# EasyEDA Pro project Macro Pad.eprj

# Schematic Schematic1
Board Name: Board1; Create Date: 2024-01-24; Project Name: Macro Pad; Schematic Name: Schematic1; Update Date: 2024-09-08; Company: t; Drawn: Tiebe Groosman; Version: V0.2
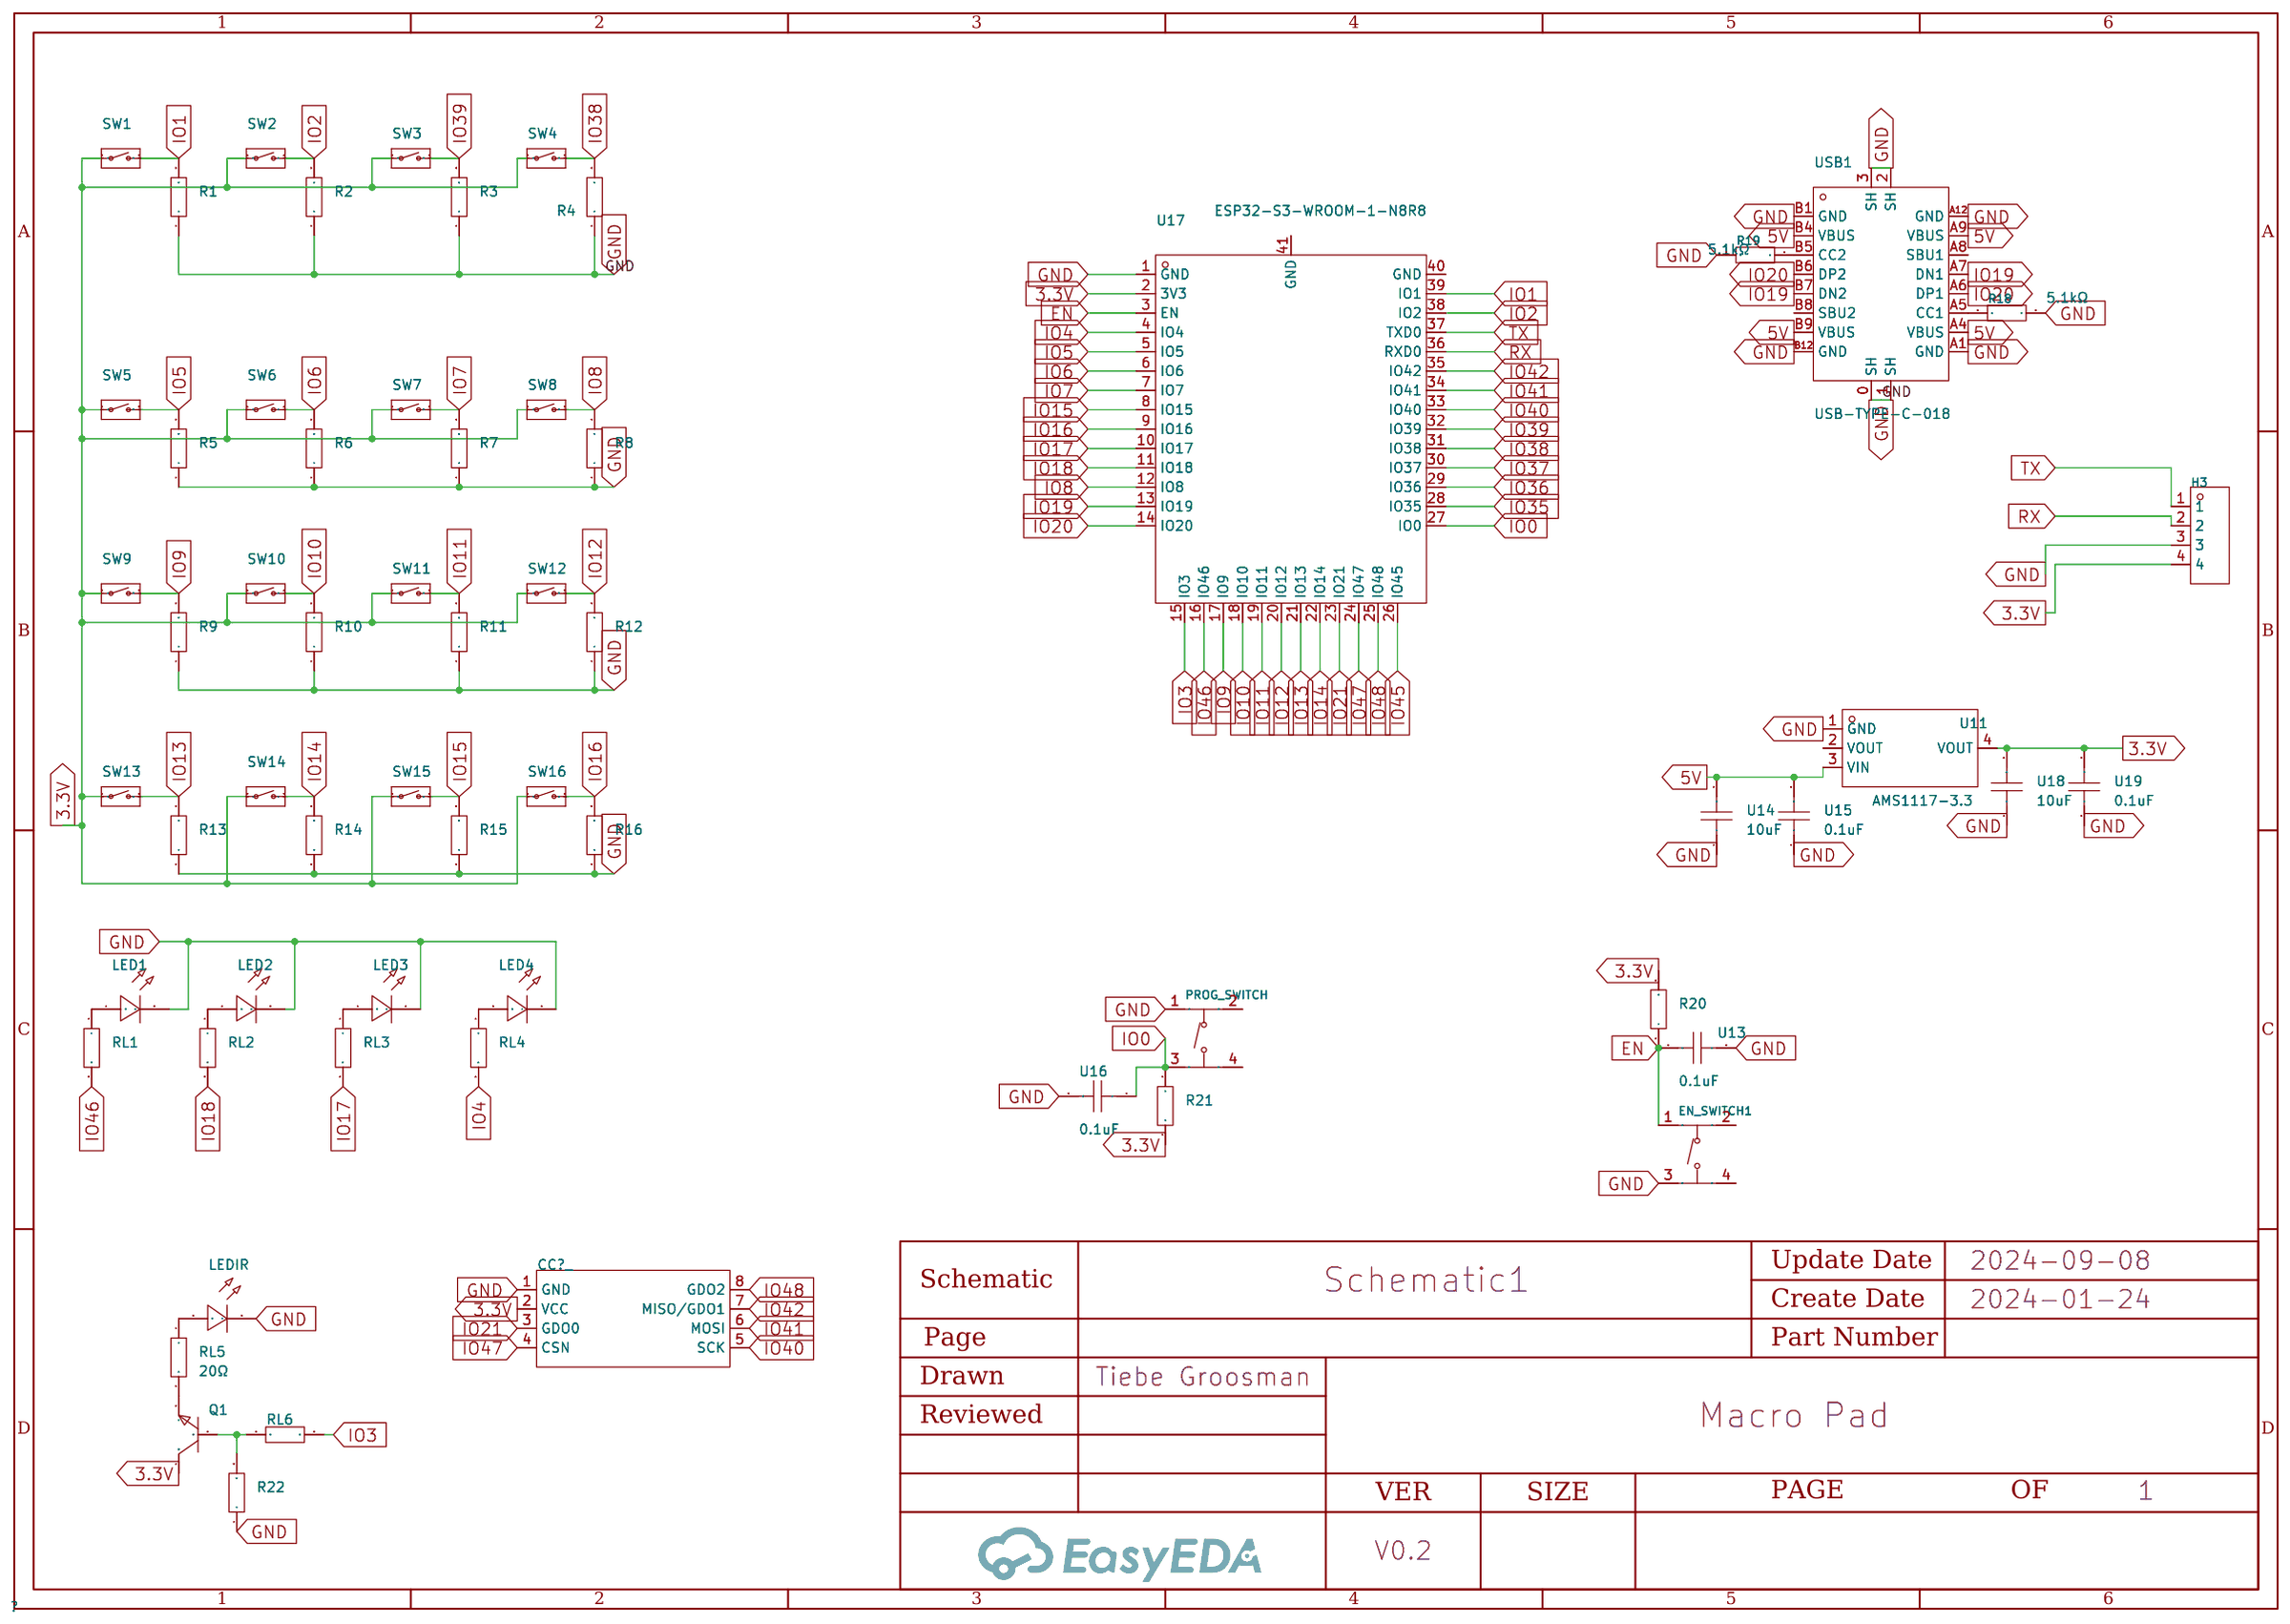
[diagram p0: schematic sheet]

## Parts
CC?_  -  [CC1101-BOARS]
EN_SWITCH1  TS-1187A-B-A-B  [SW-SMD_4P-L5.1-W5.1-P3.70-LS6.5-TL-2]
H3  -  [HDR-TH_4P-P2.54-V-M]
LED1  -  [LED-TH_BD5.8-P2.54-FD]
LED2  -  [LED-TH_BD5.8-P2.54-FD]
LED3  -  [LED-TH_BD5.8-P2.54-FD]
LED4  -  [LED-TH_BD5.8-P2.54-FD]
LEDIR  -  [LED-TH_BD5.8-P2.54-FD]
PROG_SWITCH  TS-1187A-B-A-B  [SW-SMD_4P-L5.1-W5.1-P3.70-LS6.5-TL-2]
Q1  -  [SOT-23_L2.9-W1.3-P1.90-LS2.4-BR]
R1  10.2kΩ  [R1210]
R2  10.2kΩ  [R1210]
R3  10.2kΩ  [R1210]
R4  10.2kΩ  [R1210]
R5  10.2kΩ  [R1210]
R6  10.2kΩ  [R1210]
R7  10.2kΩ  [R1210]
R8  10.2kΩ  [R1210]
R9  10.2kΩ  [R1210]
R10  10.2kΩ  [R1210]
R11  10.2kΩ  [R1210]
R12  10.2kΩ  [R1210]
R13  10.2kΩ  [R1210]
R14  10.2kΩ  [R1210]
R15  10.2kΩ  [R1210]
R16  10.2kΩ  [R1210]
R18  5.1kΩ  [R1210]
R19  5.1kΩ  [R1210]
R20  10.2kΩ  [R1210]
R21  10.2kΩ  [R1210]
R22  10.2kΩ  [R1210]
RL1  330Ω  [R1210]
RL2  330Ω  [R1210]
RL3  330Ω  [R1210]
RL4  330Ω  [R1210]
RL5  20Ω  [R1210]
RL6  330Ω  [R1210]
SW1  CHERRY-MX-LED  [CHERRYMX]
SW2  CHERRY-MX-LED  [CHERRYMX]
SW3  CHERRY-MX-LED  [CHERRYMX]
SW4  CHERRY-MX-LED  [CHERRYMX]
SW5  CHERRY-MX-LED  [CHERRYMX]
SW6  CHERRY-MX-LED  [CHERRYMX]
SW7  CHERRY-MX-LED  [CHERRYMX]
SW8  CHERRY-MX-LED  [CHERRYMX]
SW9  CHERRY-MX-LED  [CHERRYMX]
SW10  CHERRY-MX-LED  [CHERRYMX]
SW11  CHERRY-MX-LED  [CHERRYMX]
SW12  CHERRY-MX-LED  [CHERRYMX]
SW13  CHERRY-MX-LED  [CHERRYMX]
SW14  CHERRY-MX-LED  [CHERRYMX]
SW15  CHERRY-MX-LED  [CHERRYMX]
SW16  CHERRY-MX-LED  [CHERRYMX]
U11  AMS1117-3.3  [SOT-223-3_L6.5-W3.4-P2.30-LS7.0-BR]
U13  0.1uF  [C1210]
U14  10uF  [C1210]
U15  0.1uF  [C1210]
U16  0.1uF  [C1210]
U17  ESP32-S3-WROOM-1-N8R8  [WIRELM-SMD_ESP32-S3-WROOM-1]
U18  10uF  [C1210]
U19  0.1uF  [C1210]
USB1  USB-TYPE-C-018  [USB-C_SMD-TYPE-C-31-M-12]

## Library data of the parts
CC?_ = CC1101 Module
EN_SWITCH1 PROG_SWITCH = TS-1187A-B-A-B: Circuit:SPST Actuator Style:Round Button Operating Force:160gf Mounting Style:Brick nogging Switch Length:5.1mm Switch Width:5.1mm Switch Height:1.5mm Strike Gundam:不带 Contact Current:50mA Voltage Rating (DC):12V Insulation Resistance:- Actuator/Cap Color; LCSC Part Name: 5.1*5.1*1.5mm 立贴 轻触开关; Supplier Part: C318884; Manufacturer: XKB Connectivity(中国星坤); Supplier Footprint: SMD; JLCPCB Part Class: Basic Part; Datasheet: https://atta.szlcsc.com/upload/public/pdf/source/20200227/C318890_053E50208A88A7BA1965D8746000774E.pdf; Supplier: LCSC; Circuit: SPST; Actuator Style: Round Button; Operating Force: 160gf; Mounting Style: Brick nogging; Switch Length: 5.1mm; Switch Width: 5.1mm; Switch Height: 1.5mm; Strike Gundam: 不带; Contact Current: 50mA; Voltage Rating (DC): 12V; Actuator/Cap Color: 金色; With Lamp: No; Mechanical Life: 10万次; Operating Temperature: -30℃~+85℃
H3 = HDR-M_2.54_1x4P: Supplier Footprint: Through; Check: false
LED1-LED4 = LED_TH-R_5mm: Supplier Footprint: Through; Check: false
LEDIR = LED_TH-R_5mm: Supplier Footprint: Through
Q1 = S8050_NPN: Supplier Footprint: SOT-23
R1-R16 R20-R22 = 1210W2F1022T5E: Type:Thick Film Resistors Resistance:10200Ω Tolerance:±1% Tolerance:±1% Power(Watts): Overload Voltage (Max): Temperature Coefficient:±100ppm/℃ Temperature Coefficient:±100ppm/℃ Operating Temperature Range:-55℃~+155℃ Operating Temperature Range:-55℃~+155℃; LCSC Part Name: 10.2kΩ ±1% 500mW 厚膜电阻; Supplier Part: C407225; Manufacturer: UNI-ROYAL(厚声); Supplier Footprint: 1210; JLCPCB Part Class: Extended Part; Datasheet: https://atta.szlcsc.com/upload/public/pdf/source/20200306/C422600_1E6D84923E4A46A82E41ADD87F860B5C.pdf; Supplier: LCSC; Type: Thick Film Resistors; Tolerance: ±1%; Temperature Coefficient: ±100ppm/℃; Operating Temperature Range: -55℃~+155℃
R18 R19 = SCR1210J5K1: Type:Thick Film Resistors Resistance: Tolerance:±5% Tolerance:±5% Power(Watts): Overload Voltage (Max): Operating Temperature Range:-55℃~+155℃ Operating Temperature Range:-55℃~+155℃; LCSC Part Name: 厚膜电阻 5.1kΩ ±5% 500mW; Supplier Part: C3018207; Manufacturer: VO(翔胜); Supplier Footprint: 1210; JLCPCB Part Class: Extended Part; Datasheet: https://atta.szlcsc.com/upload/public/pdf/source/20220513/247AF9639BA21CF93567DC289CCC6A22.pdf; Supplier: LCSC; Type: Thick Film Resistors; Tolerance: ±5%; Operating Temperature Range: -55℃~+155℃; Temperature Coefficient: ±100ppm/℃
RL1-RL6 = RTT12331JTP: Type:Thick Film Resistors Resistance: Tolerance:±5% Tolerance:±5% Power(Watts): Overload Voltage (Max): Temperature Coefficient:±100ppm/℃ Temperature Coefficient:±100ppm/℃ Operating Temperature Range:-55℃~+155℃ Operating Temperature Range:-55℃~+155℃; LCSC Part Name: 厚膜电阻 330Ω ±5% 500mW; Supplier Part: C105006; Manufacturer: RALEC(旺诠); Supplier Footprint: 1210; JLCPCB Part Class: Extended Part; Datasheet: https://atta.szlcsc.com/upload/public/pdf/source/20191219/C158410_884373A5B7E1BC76BF57BC45A946C093.pdf; Supplier: LCSC; Type: Thick Film Resistors; Tolerance: ±5%; Temperature Coefficient: ±100ppm/℃; Operating Temperature Range: -55℃~+155℃
SW1-SW16 = CHERRY-MX-LED: Manufacturer Part: Cherry MX Green; Supplier: MechBoards.co.uk; Supplier Part: ACHERSW0115317; Manufacturer: Cherry; link: https://mechboards.co.uk/products/cherry-mx-green#full-description
U11 = AMS1117-3.3_C6186: LCSC Part Name: 输出3.3V 1A; Supplier Part: C6186; Manufacturer: AMS; Supplier Footprint: SOT-223; JLCPCB Part Class: Basic Part; Datasheet: https://atta.szlcsc.com/upload/public/pdf/source/20180727/C6186_7A095716F0823C02F1997A905E26C086.pdf; Supplier: LCSC; Output Voltage: 3.3V; MAX Output Current: 1A; Power Supply Rejection Ratio (PSRR): 72dB@(120Hz); Dropout Voltage: 1.3V@(800mA); Output Polarity: Positive electrode; Number of Outputs: 1
U13-U16 U18 U19 = CC1210KKX7R9BB105: Capacitance: Tolerance:±10% Tolerance:±10% Voltage Rated: Temperature Coefficient:; LCSC Part Name: 1uF ±10% 50V; Supplier Part: C393665; Manufacturer: YAGEO(国巨); Supplier Footprint: 1210; JLCPCB Part Class: Extended Part; Datasheet: https://atta.szlcsc.com/upload/public/pdf/source/20190520/C393665_3DDFDA27C82302498F1E69DB0F181365.pdf; Supplier: LCSC; Tolerance: ±10%; Voltage Rated: 50V
U17 = ESP32-S3-WROOM-1-N8R8: Supplier Part: C2913201; Manufacturer: ESPRESSIF(乐鑫); Supplier Footprint: SMD,25.5x18mm; JLCPCB Part Class: Extended Part; Datasheet: https://atta.szlcsc.com/upload/public/pdf/source/20240130/9D71F4DF55874C504AB629FEEE3F038E.pdf; Supplier: LCSC
USB1 = USB-TYPE-C-018: Connector Type:Type-C Standard:- Gender:Female Mounting Style:卧贴 Number of Contacts:16P Number of Ports:1 Current Rating - Power (Max):3A Operating Temperature Range:-25℃~+85℃ Operating Temperature Range:-25℃~+85℃; LCSC Part Name: Type-C 母 卧贴; Supplier Part: C2927038; Manufacturer: DEALON(德艺隆); Supplier Footprint: SMD; JLCPCB Part Class: Extended Part; Datasheet: https://atta.szlcsc.com/upload/public/pdf/source/20211217/CCD3D517E355E8E0CC52ABD8D5784AD8.pdf; Supplier: LCSC; Connector Type: Type-C; Gender: Female; Number of Ports: 1; Number of Contacts: 16P; Mounting Style: 卧贴; Current Rating - Power (Max): 3A; Operating Temperature Range: -25℃~+85℃

## Nets
3.3V: CC?_.2(VCC) H3.4 Q1.3(C) R20.2 R21.1 SW1.1 SW2.1 SW3.1 SW4.1 SW5.1 SW6.1 SW7.1 SW8.1 SW9.1 SW10.1 SW11.1 SW12.1 SW13.1 SW14.1 SW15.1 SW16.1 U11.4(VOUT) U17.2(3V3) U18.2 U19.2
5V: U11.3(VIN) U14.2 U15.2 USB1.A4(VBUS) USB1.A9(VBUS) USB1.B4(VBUS) USB1.B9(VBUS)
GND: CC?_.1(GND) EN_SWITCH1.3(C) H3.3 LED1.2(A) LED2.2(A) LED3.2(A) LED4.2(A) LEDIR.2(A) PROG_SWITCH.1(A) R1.1 R2.1 R3.1 R4.1 R5.1 R6.1 R7.1 R8.1 R9.1 R10.1 R11.1 R12.1 R13.1 R14.1 R15.1 R16.1 R18.1 R19.1 R22.1 U11.1(GND) U13.2 U14.1 U15.1 U16.2 U17.1(GND) U18.1 U19.1 USB1.0(SH) USB1.1(SH) USB1.2(SH) USB1.3(SH) USB1.A1(GND) USB1.A12(GND) USB1.B1(GND) USB1.B12(GND)
EN: EN_SWITCH1.1(A) R20.1 U13.1 U17.3(EN)
IO0: PROG_SWITCH.3(C) R21.2 U16.1 U17.27(IO0)
IO1: R1.2 SW1.2 U17.39(IO1)
IO2: R2.2 SW2.2 U17.38(IO2)
IO3: RL6.2 U17.15(IO3)
IO4: RL4.2 U17.4(IO4)
IO5: R5.2 SW5.2 U17.5(IO5)
IO6: R6.2 SW6.2 U17.6(IO6)
IO7: R7.2 SW7.2 U17.7(IO7)
IO8: R8.2 SW8.2 U17.12(IO8)
IO9: R9.2 SW9.2 U17.17(IO9)
IO10: R10.2 SW10.2 U17.18(IO10)
IO11: R11.2 SW11.2 U17.19(IO11)
IO12: R12.2 SW12.2 U17.20(IO12)
IO13: R13.2 SW13.2 U17.21(IO13)
IO14: R14.2 SW14.2 U17.22(IO14)
IO15: R15.2 SW15.2 U17.8(IO15)
IO16: R16.2 SW16.2 U17.9(IO16)
IO17: RL3.2 U17.10(IO17)
IO18: RL2.2 U17.11(IO18)
IO19: U17.13(IO19) USB1.A7(DN1) USB1.B7(DN2)
IO20: U17.14(IO20) USB1.A6(DP1) USB1.B6(DP2)
IO21: CC?_.3(GDO0) U17.23(IO21)
IO35: U17.28(IO35)
IO36: U17.29(IO36)
IO37: U17.30(IO37)
IO38: R4.2 SW4.2 U17.31(IO38)
IO39: R3.2 SW3.2 U17.32(IO39)
IO40: CC?_.5(SCK) U17.33(IO40)
IO41: CC?_.6(MOSI) U17.34(IO41)
IO42: CC?_.7(MISO/GDO1) U17.35(IO42)
IO45: U17.26(IO45)
IO46: RL1.2 U17.16(IO46)
IO47: CC?_.4(CSN) U17.24(IO47)
IO48: CC?_.8(GDO2) U17.25(IO48)
RX: H3.2 U17.36(RXD0)
TX: H3.1 U17.37(TXD0)
$1N17024: LED1.1(C) RL1.1
$1N17244: LED2.1(C) RL2.1
$1N17270: LED3.1(C) RL3.1
$1N17296: LED4.1(C) RL4.1
$1N41929: R18.2 USB1.A5(CC1)
$1N42156: R19.2 USB1.B5(CC2)
$1N52929: LEDIR.1(C) RL5.1
$1N52957: Q1.2(E) RL5.2
$1N53158: Q1.1(B) R22.2 RL6.1

Not connected (* = marked no-connect by the designer): EN_SWITCH1 2(B) 4(D); PROG_SWITCH 2(B) 4(D); U11 2(VOUT); U17 40(GND) 41(GND); USB1 A8(SBU1) B8(SBU2)

# Board PCB4
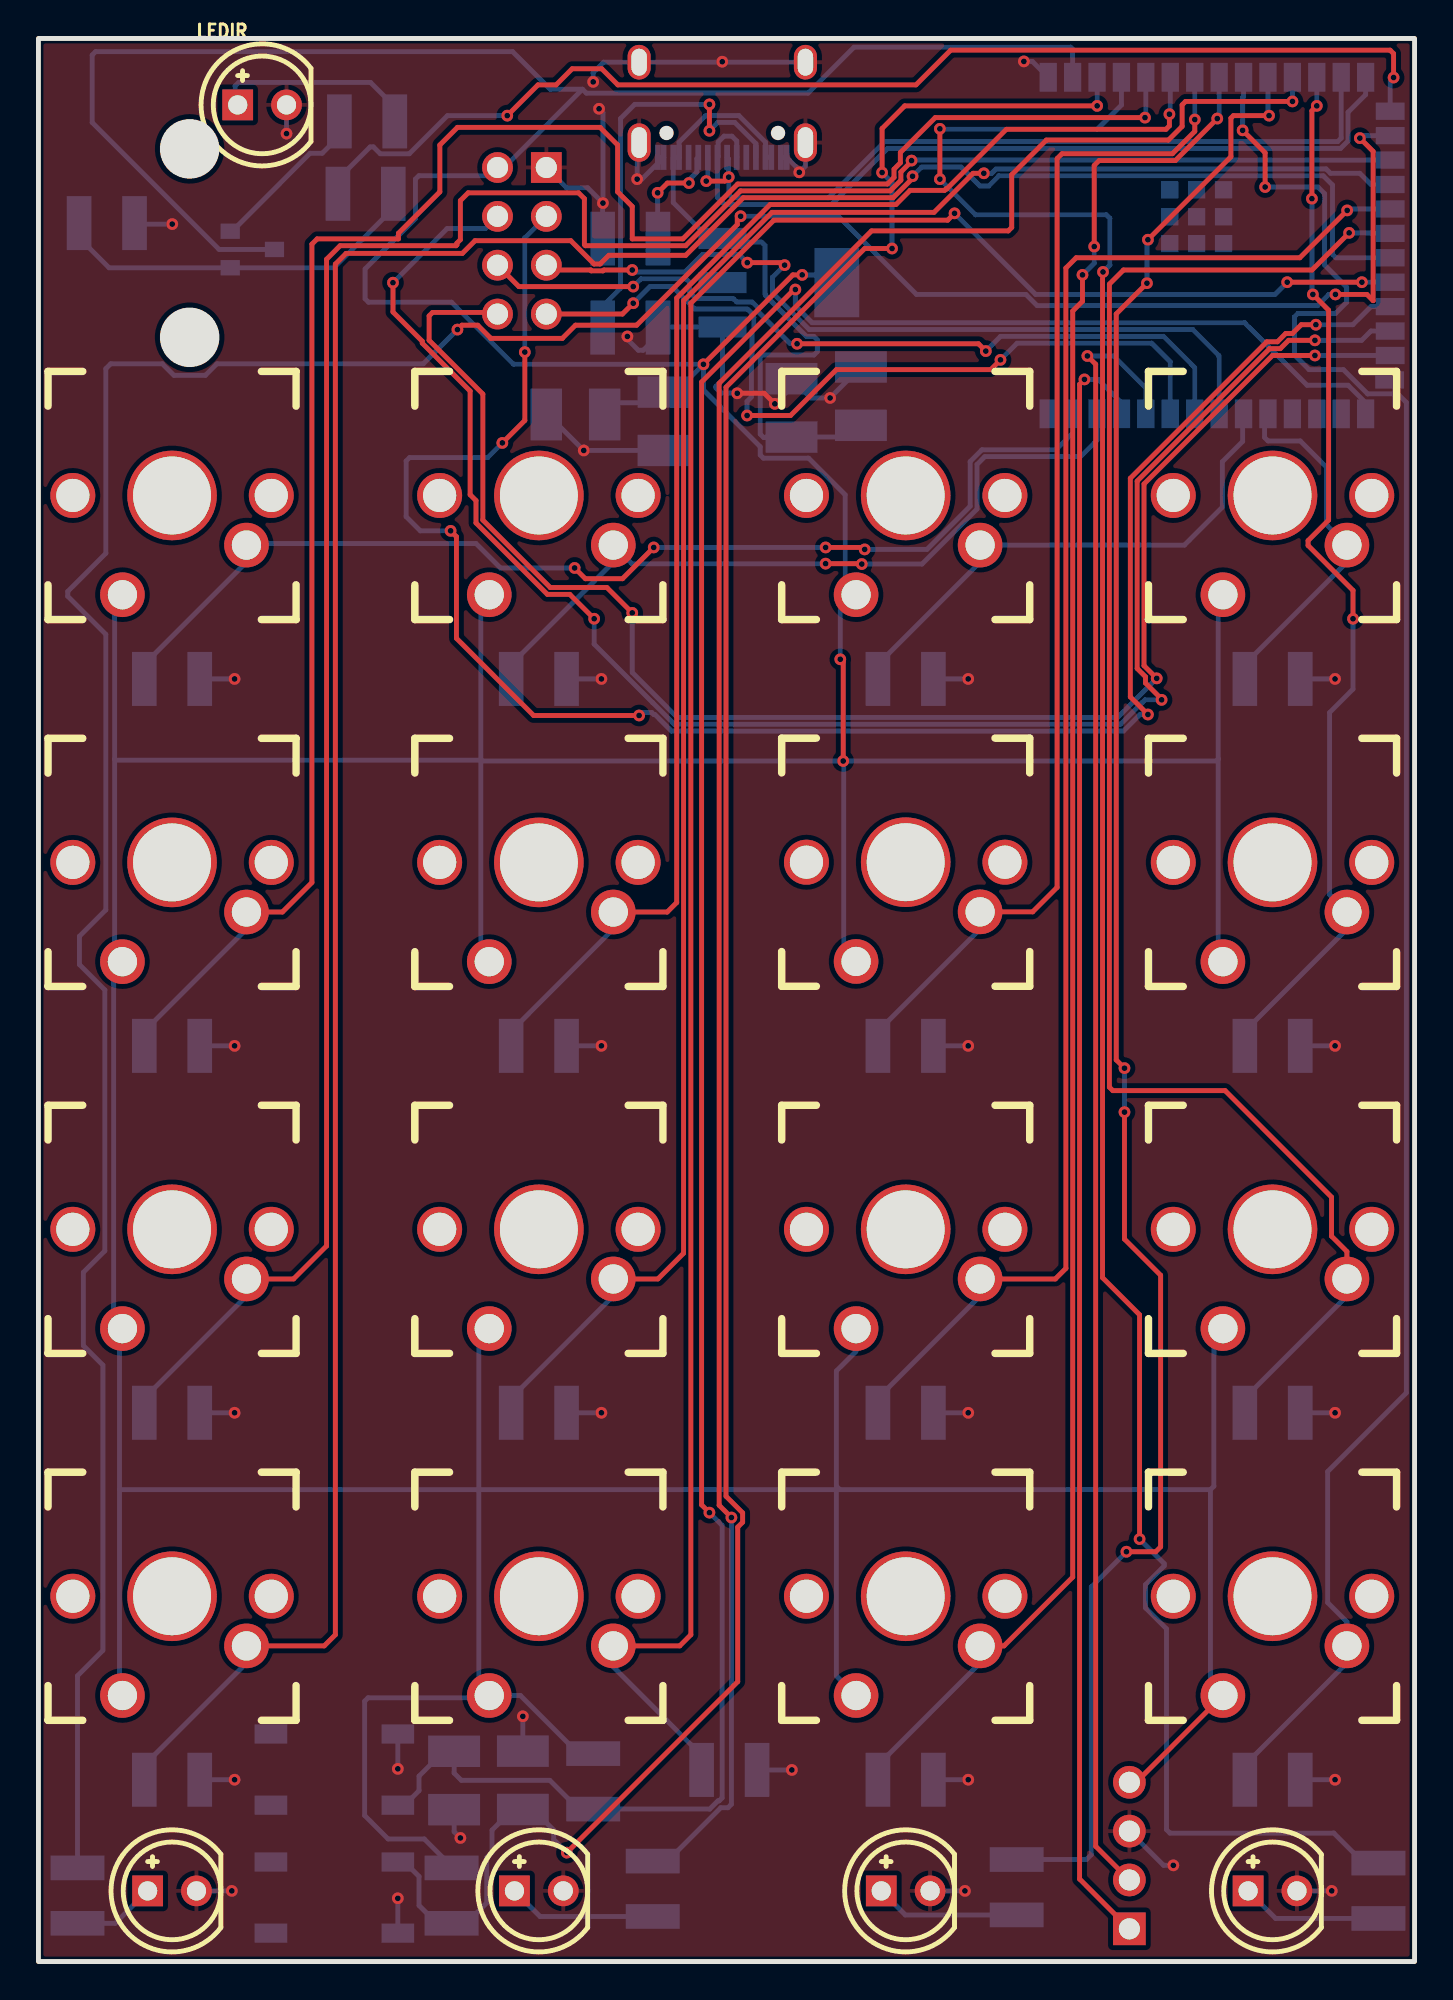
[diagram p1: board, top side]
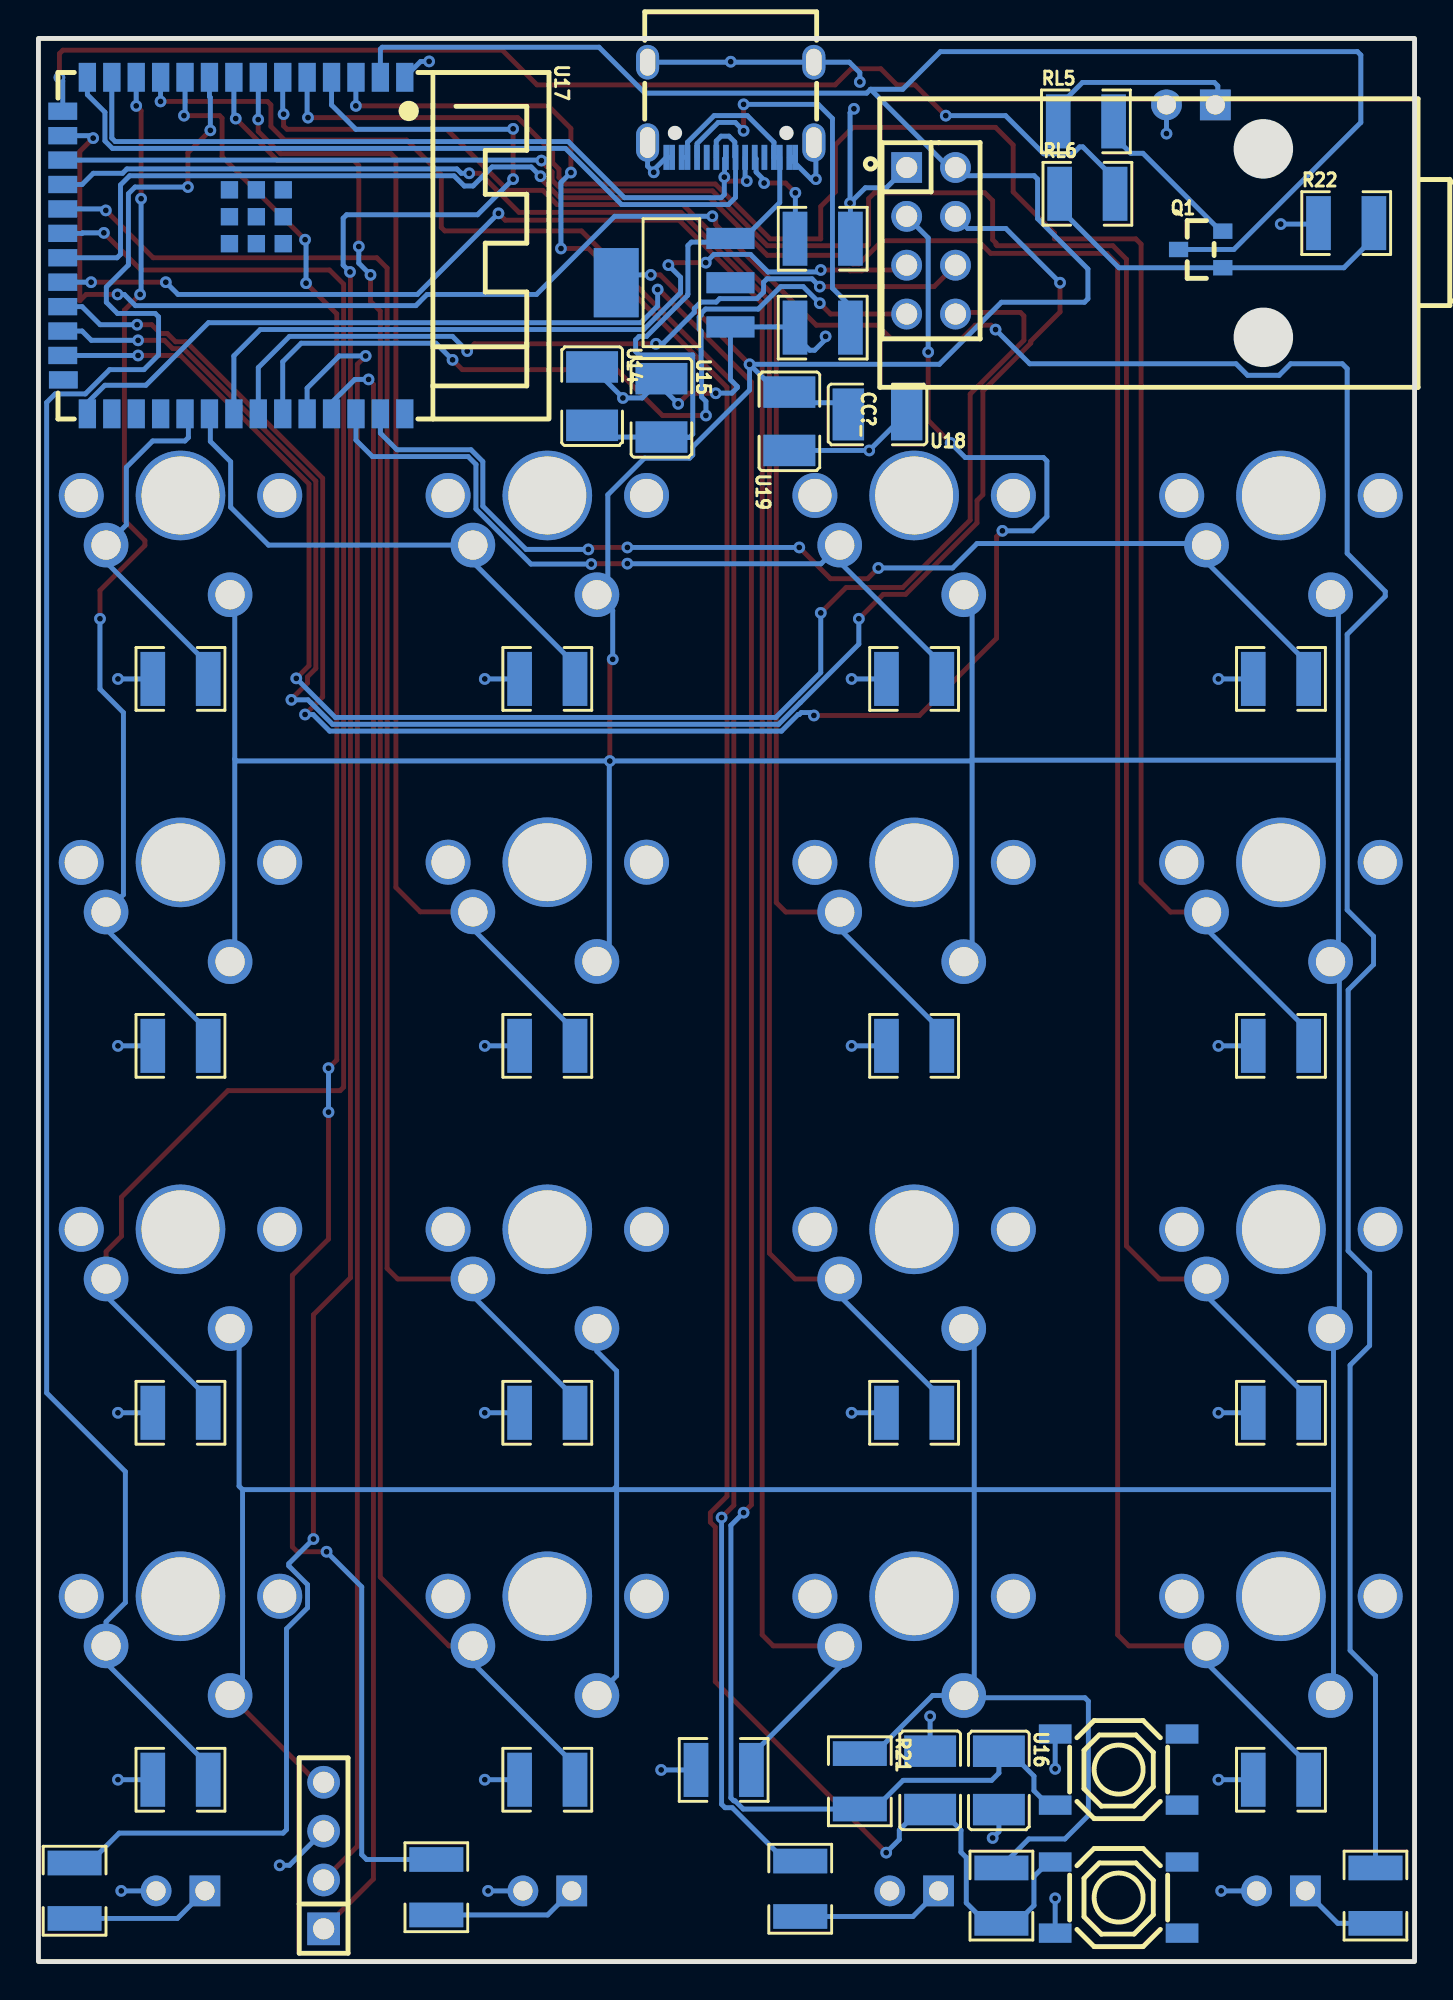
[diagram p2: board, bottom side, seen from below]

Outline 71.58 x 100 mm; copper layers: Top Layer, Bottom Layer. Coordinates in mm from the lower left corner of the outline.
Outline path: rectangle 0,100 71.58,0
Stack: Top Layer 0.035mm / Dielectric1 1.51mm FR4 er 4.5 / Bottom Layer 0.035mm

## Design rules (mm)
template: JLCPCB Capability(Two Layers Board)
spacing copperThickness1oz (default): track to track 0.102, other pairs 0.152 to 0.3
spacing copperThickness2oz: track to track 0.203, other pairs 0.152 to 0.3
track width copperThickness1oz (default): min 0.127, default 0.254, max 2.54
track width copperThickness2oz: min 0.203, default 0.254, max 2.54
differential pair differentialPair (default): width min 0.127, default 0.254, max 2.54; gap min 0.152, default 0.152
via viaSize (default): diameter min 0.5, default 0.61, max 10; hole min 0.3, default 0.305, max 6.3

## Placement (name value [footprint] x y rotation side)
CC?_  -  [CC1101-BOARS]  14.21 89.43 90 bottom
EN_SWITCH1  TS-1187A-B-A-B  [SW-SMD_4P-L5.1-W5.1-P3.70-LS6.5-TL-2]  15.39 3.33 180 bottom
H3  -  [HDR-TH_4P-P2.54-V-M]  56.74 5.51 90 bottom
LED1  -  [LED-TH_BD5.8-P2.54-FD]  6.95 3.67 0 top
LED2  -  [LED-TH_BD5.8-P2.54-FD]  26.03 3.67 0 top
LED3  -  [LED-TH_BD5.8-P2.54-FD]  45.11 3.67 0 top
LED4  -  [LED-TH_BD5.8-P2.54-FD]  64.19 3.67 0 top
LEDIR  -  [LED-TH_BD5.8-P2.54-FD]  11.63 96.54 0 top
PROG_SWITCH  TS-1187A-B-A-B  [SW-SMD_4P-L5.1-W5.1-P3.70-LS6.5-TL-2]  15.39 9.98 180 bottom
Q1  -  [SOT-23_L2.9-W1.3-P1.90-LS2.4-BR]  11.12 89.03 180 bottom
R1  10.2kΩ  [R1210]  6.95 66.7 180 bottom
R2  10.2kΩ  [R1210]  26.03 66.7 180 bottom
R3  10.2kΩ  [R1210]  45.11 66.7 180 bottom
R4  10.2kΩ  [R1210]  64.19 66.7 180 bottom
R5  10.2kΩ  [R1210]  6.95 47.62 180 bottom
R6  10.2kΩ  [R1210]  26.03 47.62 180 bottom
R7  10.2kΩ  [R1210]  45.11 47.62 180 bottom
R8  10.2kΩ  [R1210]  64.19 47.62 180 bottom
R9  10.2kΩ  [R1210]  6.95 28.54 180 bottom
R10  10.2kΩ  [R1210]  26.03 28.54 180 bottom
R11  10.2kΩ  [R1210]  45.11 28.54 180 bottom
R12  10.2kΩ  [R1210]  64.19 28.54 180 bottom
R13  10.2kΩ  [R1210]  6.95 9.46 180 bottom
R14  10.2kΩ  [R1210]  35.93 9.96 180 bottom
R15  10.2kΩ  [R1210]  45.11 9.46 180 bottom
R16  10.2kΩ  [R1210]  64.19 9.46 180 bottom
R18  5.1kΩ  [R1210]  30.78 89.59 0 bottom
R19  5.1kΩ  [R1210]  30.78 84.96 180 bottom
R20  10.2kΩ  [R1210]  21.49 3.43 90 bottom
R21  10.2kΩ  [R1210]  28.85 9.37 270 bottom
R22  10.2kΩ  [R1210]  3.56 90.4 180 bottom
RL1  330Ω  [R1210]  2.03 3.43 90 bottom
RL2  330Ω  [R1210]  31.95 3.78 90 bottom
RL3  330Ω  [R1210]  50.88 3.86 90 bottom
RL4  330Ω  [R1210]  69.7 3.68 90 bottom
RL5  20Ω  [R1210]  17.09 95.69 180 bottom
RL6  330Ω  [R1210]  17.02 91.92 180 bottom
SW1  CHERRY-MX-LED  [CHERRYMX]  6.95 76.24 0 top
SW2  CHERRY-MX-LED  [CHERRYMX]  26.03 76.24 0 top
SW3  CHERRY-MX-LED  [CHERRYMX]  45.11 76.24 0 top
SW4  CHERRY-MX-LED  [CHERRYMX]  64.19 76.24 0 top
SW5  CHERRY-MX-LED  [CHERRYMX]  6.95 57.16 0 top
SW6  CHERRY-MX-LED  [CHERRYMX]  26.03 57.16 0 top
SW7  CHERRY-MX-LED  [CHERRYMX]  45.11 57.17 0 top
SW8  CHERRY-MX-LED  [CHERRYMX]  64.19 57.16 0 top
SW9  CHERRY-MX-LED  [CHERRYMX]  6.95 38.08 0 top
SW10  CHERRY-MX-LED  [CHERRYMX]  26.03 38.08 0 top
SW11  CHERRY-MX-LED  [CHERRYMX]  45.11 38.08 0 top
SW12  CHERRY-MX-LED  [CHERRYMX]  64.19 38.08 0 top
SW13  CHERRY-MX-LED  [CHERRYMX]  6.95 19 0 top
SW14  CHERRY-MX-LED  [CHERRYMX]  26.03 19 0 top
SW15  CHERRY-MX-LED  [CHERRYMX]  45.11 19 0 top
SW16  CHERRY-MX-LED  [CHERRYMX]  64.19 19 0 top
U11  AMS1117-3.3  [SOT-223-3_L6.5-W3.4-P2.30-LS7.0-BR]  38.55 87.3 180 bottom
U13  0.1uF  [C1210]  25.2 9.42 90 bottom
U14  10uF  [C1210]  42.78 81.4 270 bottom
U15  0.1uF  [C1210]  39.17 80.79 270 bottom
U16  0.1uF  [C1210]  21.62 9.42 270 bottom
U17  ESP32-S3-WROOM-1-N8R8  [WIRELM-SMD_ESP32-S3-WROOM-1]  61.42 89.23 270 bottom
U18  10uF  [C1210]  27.93 80.45 0 bottom
U19  0.1uF  [C1210]  32.52 80.09 90 bottom
USB1  USB-TYPE-C-018  [USB-C_SMD-TYPE-C-31-M-12]  35.57 96.29 0 bottom

## Footprints (pads in the part's own frame, mm; a bottom-side part is the same pattern mirrored in y, then rotated)
C1210
  rect 1.635x2.7 smd: 1(-1.518,0) 2(1.518,0)
CC1101-BOARS
  rect 1.6x1.6 hole 1.1: 1(3.856,12.203)
  round 1.6 hole 1.1: 2(3.856,9.663) 3(1.316,12.203) 4(1.316,9.663) 5(-1.224,12.203) 6(-1.224,9.663) 7(-3.764,12.203) 8(-3.764,9.663)
CHERRYMX
  round 2.321 hole 1.524: 1(-2.58,-5.162) 2(3.871,-2.58)
  round 2.34 hole 1.727: 3(5.162,0) 4(-5.162,0)
  round 4.661 hole 4.054: 5(0,0)
HDR-TH_4P-P2.54-V-M
  rect 1.7x1.7 hole 1.1: 1(-3.81,0)
  round 1.7 hole 1.1: 2(-1.27,0) 3(1.27,0) 4(3.81,0)
LED-TH_BD5.8-P2.54-FD
  rect 1.6x1.6 hole 1: 1(-1.27,0)
  round 1.6 hole 1: 2(1.27,0)
R1210
  rect 1.282x2.808 smd: 1(-1.441,0) 2(1.441,0)
SOT-23_L2.9-W1.3-P1.90-LS2.4-BR
  rect 1x0.8 smd: 1(1.15,-0.95) 2(1.15,0.95) 3(-1.15,0)
SOT-223-3_L6.5-W3.4-P2.30-LS7.0-BR
  rect 2.5x1.1 smd: 1(2.97,-2.3) 2(2.97,0) 3(2.97,2.3)
  rect 2.34x3.6 smd: 4(-2.97,0)
SW-SMD_4P-L5.1-W5.1-P3.70-LS6.5-TL-2
  rect 1.7x1 smd: 1(-3.3,1.85) 2(3.3,1.85) 3(-3.3,-1.85) 4(3.3,-1.85)
USB-C_SMD-TYPE-C-31-M-12
  oval 1.2x2 hole 0.8x1.6: 0(-4.325,1.706) 1(4.325,1.706)
  oval 1.2x1.8 hole 0.8x1.4: 2(4.325,-2.474) 3(-4.325,-2.474)
  rect 0.3x1.3 smd: A1(-3.35,2.474) A4(-2.55,2.474) A5(-1.25,2.474) A6(-0.25,2.474) A7(0.25,2.474) A8(1.25,2.474) A9(2.55,2.474) A12(3.35,2.474) B1(3.05,2.474) B4(2.25,2.474) B5(1.75,2.474) B6(0.75,2.474) B7(-0.75,2.474) B8(-1.75,2.474) B9(-2.25,2.474) B12(-3.05,2.474)
WIRELM-SMD_ESP32-S3-WROOM-1
  rect 1.5x0.9 smd: 1(-8.75,8.895) 2(-8.75,7.625) 3(-8.75,6.355) 4(-8.75,5.085) 5(-8.75,3.815) 6(-8.75,2.545) 7(-8.75,1.275) 8(-8.75,0.005) 9(-8.75,-1.265) 10(-8.75,-2.535) 11(-8.75,-3.805) 12(-8.75,-5.075) 13(-8.75,-6.345) 14(-8.75,-7.615) 27(8.75,-7.615) 28(8.75,-6.345) 29(8.75,-5.075) 30(8.75,-3.805) 31(8.75,-2.535) 32(8.75,-1.265) 33(8.75,0.005) 34(8.75,1.275) 35(8.75,2.545) 36(8.75,3.815) 37(8.75,5.085) 38(8.75,6.355) 39(8.75,7.625) 40(8.75,8.895)
  rect 0.9x1.5 smd: 15(-6.985,-8.895) 16(-5.715,-8.895) 17(-4.445,-8.895) 18(-3.175,-8.895) 19(-1.905,-8.895) 20(-0.635,-8.895) 21(0.635,-8.895) 22(1.905,-8.895) 23(3.175,-8.895) 24(4.445,-8.895) 25(5.715,-8.895) 26(6.985,-8.865)
  rect 0.9x0.9 smd: 41(-2.9,-0.225) 41(-2.9,1.175) 41(-2.9,2.575) 41(-1.5,-0.225) 41(-1.5,1.175) 41(-1.5,2.575) 41(-0.1,-0.225) 41(-0.1,1.175) 41(-0.1,2.575)

## Nets
As in the schematic.

Pads without a net: EN_SWITCH1 2 4; PROG_SWITCH 2 4; SW1 3 4 5; SW2 3 4 5; SW3 3 4 5; SW4 3 4 5; SW5 3 4 5; SW6 3 4 5; SW7 3 4 5; SW8 3 4 5; SW9 3 4 5; SW10 3 4 5; SW11 3 4 5; SW12 3 4 5; SW13 3 4 5; SW14 3 4 5; SW15 3 4 5; SW16 3 4 5; U11 2; U17 40 41; USB1 A8 B8

## Via types
v1: diameter 0.61, hole 0.305, Top Layer to Bottom Layer, 122 vias

## Routing (per net, layer and track width the routed paths; a pad name or vN(x,y) marks a point on that pad's centre or on a via; arc(x,y) is an arc through that point)
3.3V: length 459.9
  Top Layer w0.254: SW16.1 57.1,9.32 H3.4 ; v1(41.71,67.72) 41.86,67.56 v1(41.86,62.43) ; v1(39.73,87.71) 39.24,87.71 v1(34.59,83.06)
  Bottom Layer w0.254: 60.96,24.54 60.96,14.48 SW16.1 ; 60.96,24.54 41.68,24.54 41.5,24.72 41.5,30.71 42.53,31.73 SW11.1 ; 60.96,24.54 61.14,24.72 61.14,32.45 SW12.1 ; U11.4 41.12,87.71 v1(39.73,87.71) ; 61.62,71.07 61.37,70.82 61.37,62.53 ; 61.37,62.53 61.26,62.43 41.89,62.43 41.89,52.65 SW7.1 ; 61.37,62.53 61.37,52.24 SW8.1 ; 53.79,98.08 53.79,99.45 53.7,99.54 42.42,99.54 40.03,97.16 28.5,97.16 28.3,97.36 ; v1(34.59,83.06) 34.59,81.72 37.54,78.77 37.54,78.34 37.71,78.18 40.06,78.18 41.96,76.27 41.96,71.64 SW3.1 41.71,70.25 v1(41.71,67.72) ; v1(34.59,83.06) 24.72,83.06 21.49,86.28 17.17,86.28 16.99,86.46 16.99,88.01 19.61,90.63 19.61,92.68 19.79,92.86 23.45,92.86 CC?_.2 24.23,93.29 28.3,97.36 ; v1(34.59,83.06) 33.14,81.61 U19.2 31.96,81.06 29.45,81.06 ; SW14.1 25.07,13.83 28.09,10.81 R21.1 ; SW14.1 22.9,14.38 22.9,24.54 ; SW14.1 23.33,13.72 17.15,13.72 16.97,13.54 16.97,7.59 18.19,6.37 20.07,6.37 21.49,4.95 R20.2 ; 22.9,24.54 4.22,24.54 ; 22.9,24.54 22.9,32.37 SW10.1 ; 22.9,24.54 41.5,24.54 41.5,14.86 SW15.1 ; 4.22,24.54 4.22,13.99 SW13.1 ; 4.22,24.54 4.22,32.76 SW9.1 3.91,33.37 3.91,51.54 SW5.1 3.96,52.4 3.96,62.51 ; 23.01,62.51 23.09,62.43 41.71,62.43 ; 23.01,62.51 23.01,52.43 SW6.1 ; 23.01,62.51 23.01,70.64 SW2.1 ; 23.01,62.51 22.97,62.47 4,62.47 3.96,62.51 ; 28.3,97.36 26.62,97.36 24.66,99.32 2.97,99.32 2.79,99.14 2.79,95.63 9.4,89.03 Q1.3 ; 3.96,62.51 3.96,70.67 SW1.1
5V: length 35.5
  Bottom Layer w0.254: USB1.A9 USB1.B4 37.82,94.6 36.43,95.99 34.71,95.99 33.32,94.6 USB1.B9 USB1.A4 33.02,91.46 34.88,89.6 U11.3 35.77,89.41 37.62,89.41 37.8,89.23 37.8,86.69 37.82,86.67 37.82,86.63 39.94,84.51 40.33,84.51 40.51,84.33 40.51,83.72 40.33,83.54 37.54,83.54 37.54,79.43 37.72,79.25 37.82,79.25 37.85,79.27 U15.2 42.17,79.27 U14.2
GND: length 105.9
  Top Layer w0.254: v1(38.3,81) 37.75,81.55 v1(36.35,81.55)
  Bottom Layer w0.254: 8.39,28.54 v1(10.2,28.54) ; R11.1 v1(48.36,28.54) ; 8.39,66.7 v1(10.2,66.7) ; v1(59.03,5) 58.52,5 H3.3 ; v1(36.35,81.55) 36.34,81.56 35.51,81.56 35.23,81.84 35.23,81.91 35.58,82.26 U11.1 32.54,85 32.23,85.32 32.23,84.56 31.46,83.79 31.2,83.79 30.63,84.36 v1(30.63,84.51) ; v1(29.36,91.44) 29.34,91.42 29.34,88.82 ; v1(29.36,91.44) 29.36,96.14 v1(29.16,96.34) ; v1(29.36,91.44) 28.57,92.23 27.47,92.23 CC?_.1 ; USB1.A1 USB1.B12 31.39,92.68 v1(31.14,92.68) 31.14,94.48 USB1.0 ; R3.1 v1(48.36,66.7) ; 26.42,80.45 26.49,80.45 v1(28.36,78.58) U19.1 ; 8.39,47.62 v1(10.2,47.62) ; R4.1 v1(67.44,66.7) ; R16.1 v1(67.44,9.46) ; v1(51.26,98.81) 51.7,98.81 U17.1 ; 46.55,47.62 v1(48.36,47.62) ; R6.1 v1(29.28,47.62) ; USB1.B1 USB1.A12 39.57,93.16 v1(39.57,93.04) 39.89,93.36 USB1.1 ; 27.47,28.54 v1(29.28,28.54) ; U16.2 21.62,6.75 v1(21.95,6.43) ; USB1.2 35.59,98.76 v1(35.57,98.79) 35.54,98.76 USB1.3 29.4,98.76 28.85,98.22 v1(28.85,97.74) ; LED1.2 v1(10.06,3.67) ; 65.63,47.62 v1(67.44,47.62) ; R14.1 v1(39.19,9.96) ; R15.1 v1(48.36,9.46) ; 5.4,90.35 v1(6.96,90.35) ; 8.39,9.46 v1(10.2,9.46) ; PROG_SWITCH.1 v1(18.69,10.02) ; LEDIR.2 v1(12.9,95.05) ; v1(38.3,81) 39.17,81.87 U15.1 40.18,81.3 v1(41.18,81.3) 41.18,81.31 U14.1 ; LED3.2 v1(48.19,3.67) ; R12.1 v1(67.44,28.54) ; U13.2 v1(25.2,12.75) ; LED4.2 v1(67.27,3.67) ; 27.47,66.7 v1(29.28,66.7) ; EN_SWITCH1.3 v1(18.69,3.29)
EN: length 128.3
  Top Layer w0.254: v1(44.4,89.08) 42.98,89.08 35.76,81.86 35.76,24.19 36.63,23.33 36.63,22.85 36.37,22.59 36.37,14.55 v1(27.48,5.66) ; v1(55.07,96.49) 45.06,96.49 43.88,95.32 v1(43.88,93.03)
  Bottom Layer w0.254: v1(44.4,89.08) 44.4,92.51 v1(43.88,93.03) ; U17.3 55.07,97.97 v1(55.07,96.49) ; EN_SWITCH1.1 19.04,5.18 19.8,4.42 19.8,2.92 20.73,1.99 R20.1 22.25,1.99 23.32,3.05 23.32,5.41 23.59,5.69 23.59,6.83 24.66,7.91 U13.1 25.73,7.91 26.8,6.83 26.8,6.35 v1(27.48,5.66)
IO0: length 134.7
  Top Layer w0.254: v1(39.37,86.94) 39.3,86.94 34.49,82.13 34.49,23.75 v1(34.9,23.34)
  Bottom Layer w0.254: PROG_SWITCH.3 19.04,8.13 19.8,8.89 19.8,9.64 21.09,10.93 U16.1 21.62,9.8 22,9.42 26.6,9.42 28.09,7.93 R21.2 34.92,7.93 35.34,8.36 35.41,8.36 35.56,8.51 35.56,22.68 v1(34.9,23.34) ; U17.27 69.03,81.06 68.12,81.97 65.99,81.97 62.73,85.22 40.24,85.22 39.37,86.09 v1(39.37,86.94)
IO1: length 58.5
  Top Layer w0.254: v1(32,73.53) 30.38,71.91 28.45,71.91 v1(27.89,72.47) ; v1(42.98,73.43) 42.87,73.53 v1(40.94,73.53)
  Bottom Layer w0.254: U17.39 53.79,79.48 52.93,78.61 49.08,78.61 48.46,78 48.46,75.68 46.22,73.43 v1(42.98,73.43) ; v1(27.89,72.47) 24.03,72.47 22.76,73.74 10.9,73.74 SW1.2 10.82,72.77 5.51,67.46 R1.2 ; v1(40.94,73.53) v1(32,73.53)
IO2: length 40.1
  Top Layer w0.254: v1(42.82,72.67) 42.8,72.69 v1(40.94,72.69)
  Bottom Layer w0.254: R2.2 24.59,67.46 29.9,72.77 SW2.2 30.87,72.68 40.94,72.68 v1(40.94,72.69) ; v1(42.82,72.67) 45.96,72.67 48.82,75.53 48.82,77.85 49.23,78.26 54.2,78.26 55.06,79.12 U17.38
IO3: length 62.6
  Top Layer w0.254: v1(70.49,97.97) 70.49,99.21 70.31,99.39 47.45,99.39 45.64,97.59 30.14,97.59 29.3,98.42 27.76,98.42 26.92,97.59 25.98,97.59 v1(24.38,95.99)
  Bottom Layer w0.254: U17.15 70.31,97.79 v1(70.49,97.97) ; RL6.2 15.58,92.68 17.25,94.36 17.42,94.36 17.78,94 19.29,94 21.27,95.99 v1(24.38,95.99)
IO4: length 121.5
  Top Layer w0.254: 55.37,87.66 v1(55.37,87.86) ; v1(46.89,92.68) v1(46.89,95.3) ; v1(57.27,21.97) 57.27,33.63 55.35,35.56 55.35,87.53
  Bottom Layer w0.254: RL4.2 68.93,5.12 67.38,6.68 58.85,6.68 58.67,6.86 58.67,17.3 57.58,18.4 57.58,19.6 58.56,20.57 58.56,20.69 v1(57.27,21.97) ; v1(46.89,92.68) 48.74,90.83 55.55,90.83 55.73,90.65 55.73,88.21 v1(55.37,87.86) ; v1(46.89,95.3) 46.91,95.27 55.07,95.27 56.33,96.54 56.33,97.98
IO5: length 104
  Top Layer w0.254: v1(57.56,95.88) 46.65,95.88 44.83,94.07 44.83,93.53 44.5,93.2 44.5,92.77 44.16,92.43 36.37,92.43 33.52,89.58 30.89,89.58 30.89,91.26 30.12,92.02 30.12,94.46 29.21,95.38 21.79,95.38 20.88,94.46 20.88,92.02 18.72,89.87 18.72,89.58 14.5,89.58 14.22,89.3 14.22,56.11 12.69,54.57 SW5.2
  Bottom Layer w0.254: R5.2 5.51,48.38 10.82,53.69 SW5.2 ; v1(57.56,95.88) 57.6,95.93 U17.5
IO6: length 76
  Top Layer w0.254: v1(58.83,96.06) 58.83,95.45 58.65,95.27 50.34,95.27 47.24,92.18 47.21,92.18 47.13,92.1 45.34,92.1 44.6,91.36 38.06,91.36 33.2,86.5 33.2,55.07 32.71,54.57 SW6.2
  Bottom Layer w0.254: SW6.2 29.9,53.69 24.59,48.38 R6.2 ; U17.6 58.87,96.11 v1(58.83,96.06)
IO7: length 62.2
  Top Layer w0.254: v1(60.15,95.78) 60.15,95.17 58.98,94.01 53.24,94.01 52.98,93.75 52.98,55.85 51.71,54.58 SW7.2
  Bottom Layer w0.254: v1(60.15,95.78) 60.14,95.79 U17.7 ; R7.2 43.67,48.38 48.98,53.69 SW7.2
IO8: length 55.2
  Top Layer w0.254: v1(66.29,86.69) 67.11,85.87 67.11,74.95 66.04,73.89 66.04,73.63 68.38,71.3 68.38,69.93 ; v1(66.24,91.67) 66.24,96.24 v1(66.49,96.49)
  Bottom Layer w0.254: v1(66.24,91.67) 66.24,86.74 v1(66.29,86.69) ; 66.49,97.98 v1(66.49,96.49) ; v1(68.38,69.82) 68.38,66.17 67.16,64.95 67.16,55.48 SW8.2 68.06,53.69 62.75,48.38 R8.2
IO9: length 128
  Top Layer w0.254: SW9.2 13.27,35.49 14.99,37.21 14.99,88.52 15.69,89.22 21.72,89.22 21.77,89.27 21.77,89.35 21.95,89.53 21.95,91.57 22.35,91.97 28.09,91.97 28.4,91.67 28.4,89.28 28.45,89.22 33.66,89.22 36.52,92.07 44.31,92.07 44.86,92.63 44.86,93.06 45.42,93.61 v1(45.42,93.65)
  Bottom Layer w0.254: SW9.2 10.82,34.61 5.51,29.3 R9.2 ; v1(45.42,93.65) 45.44,93.67 U17.17
IO10: length 102.8
  Top Layer w0.254: SW10.2 32.22,35.49 33.55,36.83 33.55,86.36 38.15,90.96 46.58,90.96 48.62,92.99 v1(49.17,92.99)
  Bottom Layer w0.254: v1(49.17,92.99) 49.58,92.99 49.81,93.21 66.98,93.21 67.2,92.99 68.72,92.99 69.31,92.4 U17.18 ; R10.2 24.59,29.3 29.9,34.61 SW10.2
IO11: length 84
  Top Layer w0.254: v1(68.07,91.06) 65.61,88.59 53.98,88.59 53.44,88.06 53.44,36.04 52.89,35.49 SW11.2
  Bottom Layer w0.254: SW11.2 48.98,34.61 43.67,29.3 R11.2 ; v1(68.07,91.06) 68.15,91.13 U17.19
IO12: length 85.2
  Top Layer w0.254: SW12.2 68.06,36.92 67.26,37.72 67.26,39.75 61.72,45.29 55.88,45.29 55.7,45.47 55.7,87.22 56.44,87.96 66.24,87.96 v1(68.17,89.89)
  Bottom Layer w0.254: R12.2 62.75,29.3 68.06,34.61 SW12.2 ; U17.20 69.31,89.86 69.28,89.89 v1(68.17,89.89)
IO13: length 147.8
  Top Layer w0.254: SW13.2 14.87,16.41 15.44,16.99 15.44,88.26 16,88.82 22.05,88.82 22.71,89.48 27.69,89.48 28.9,88.27 29.22,88.27 29.67,88.72 33.67,88.72 36.66,91.72 44.45,91.72 45.47,92.73 v1(45.47,92.84)
  Bottom Layer w0.254: v1(45.47,92.84) 45.95,93.32 47.98,93.32 48.97,92.33 49.43,92.33 49.96,92.86 66.83,92.86 67.31,92.38 67.31,88.77 67.49,88.59 U17.21 ; SW13.2 10.82,15.53 5.51,10.22 R13.2
IO14: length 122.2
  Top Layer w0.254: SW14.2 33.36,16.41 33.93,16.99 33.93,86.23 38.25,90.55 47.29,90.55 v1(47.65,90.91) ; v1(64.95,87.32) v1(68.84,87.32)
  Bottom Layer w0.254: R14.2 34.49,10.73 29.9,15.32 SW14.2 ; v1(47.65,90.91) 51.87,86.69 64.32,86.69 v1(64.95,87.32) ; U17.22 v1(68.84,87.32)
IO15: length 98.9
  Top Layer w0.254: SW15.2 50.22,16.41 53.8,19.99 53.8,85.83 54.3,86.33 v1(54.3,87.71) ; v1(61.32,95.83) 59.13,93.65 55.17,93.65 54.91,93.4 v1(54.91,89.18)
  Bottom Layer w0.254: v1(54.3,87.71) 54.91,88.32 v1(54.91,89.18) ; U17.8 61.41,95.93 v1(61.32,95.83) ; SW15.2 48.98,15.53 43.67,10.22 R15.2
IO16: length 103.4
  Top Layer w0.254: v1(62.64,95.22) 63.8,94.05 v1(63.8,92.27)
  Bottom Layer w0.254: U17.9 62.68,96.98 62.64,96.93 v1(62.64,95.22) ; v1(63.8,92.27) 66.55,92.27 66.9,91.93 66.9,88.22 68.05,87.07 68.05,86.28 67.47,85.7 65.51,85.7 65.33,85.52 65.33,83.54 66.09,82.78 67.88,82.78 69.14,81.52 70.71,81.52 71.15,81.07 71.15,29.57 67.06,25.48 67.06,18.67 68.06,17.66 SW16.2 68.06,15.53 62.75,10.22 R16.2
IO17: length 104.2
  Top Layer w0.254: v1(56.49,44.17) 56.49,37.57 58.37,35.69 58.37,21.56 58.11,21.31 v1(56.59,21.31) ; v1(57.71,89.53) 62.03,93.85 62.03,95.86 62.15,95.99 v1(64.01,95.99) ; v1(56.49,46.46) 56.06,46.88 56.06,85.68 v1(57.66,87.27)
  Bottom Layer w0.254: v1(57.71,89.53) 57.66,89.48 v1(57.66,87.27) ; v1(56.49,44.17) v1(56.49,46.46) ; U17.10 63.95,96.04 v1(64.01,95.99) ; v1(56.59,21.31) 54.76,19.48 54.76,5.56 54.51,5.31 RL3.2
IO18: length 118.9
  Top Layer w0.254: v1(65.23,96.72) 59.67,96.72 59.49,96.54 59.49,95.43 58.78,94.72 52.43,94.72 50.62,92.91 50.62,90.17 50.44,89.99 43.33,89.99 35.41,82.07 35.41,23.72 v1(36.04,23.09)
  Bottom Layer w0.254: v1(65.23,96.72) 65.23,97.97 U17.11 ; v1(36.04,23.09) 36.04,8.18 35.86,8 35.49,8 32.72,5.23 RL2.2
IO19: length 41
  Top Layer w0.254: v1(34.73,92.58) 35.7,92.58 v1(35.9,92.79)
  Bottom Layer w0.254: USB1.A7 35.89,93.75 35.89,92.8 v1(35.9,92.79) 35.9,91.89 36.07,91.72 41.1,91.72 44.02,94.64 67.58,94.64 67.76,94.82 67.76,98.08 ; v1(34.73,92.58) 34.82,92.67 USB1.B7
IO20: length 43.1
  Bottom Layer w0.254: 69.03,98.08 69.03,97.08 68.12,96.16 68.12,94.67 67.73,94.28 44.16,94.28 41.24,91.36 35.69,91.36 35.32,91.73 USB1.A6 35.36,93.85 35.36,94.61 35.66,94.92 36.07,94.92 36.32,94.67 36.32,93.82 USB1.B6
IO21: length 97.7
  Top Layer w0.254: v1(31.24,64.79) 25.76,64.79 21.74,68.81 21.74,74.09 v1(21.44,74.4) ; v1(25.3,83.69) 25.3,80.14 v1(24.13,78.97) ; v1(57.71,64.85) 56.79,65.76 56.79,77.13 63.89,84.23 64.45,84.23 64.88,84.66 65.23,84.66 65.68,85.11 v1(66.45,85.11)
  Bottom Layer w0.254: v1(21.44,74.4) 19.86,74.4 19.12,75.13 19.12,78.03 19.3,78.21 23.37,78.21 v1(24.13,78.97) ; v1(57.71,64.85) 57.29,64.85 56.43,63.98 32.93,63.98 32.06,64.85 32,64.85 31.9,64.95 31.39,64.95 v1(31.24,64.79) ; v1(25.3,83.69) 25.3,89.63 CC?_.3 ; U17.23 69.31,86.05 68.37,85.11 v1(66.45,85.11)
IO38: length 18.8
  Bottom Layer w0.254: U17.31 63.78,80.3 63.78,79.25 63.96,79.07 65.63,79.07 67.01,77.7 67.01,74.71 SW4.2 68.06,72.77 62.75,67.46 R4.2
IO39: length 27.9
  Bottom Layer w0.254: U17.32 62.64,80.43 62.64,79.05 61.58,77.99 61.58,75.63 59.61,73.65 SW3.2 48.98,72.77 43.67,67.46 R3.2
IO40: length 42.5
  Top Layer w0.254: CC?_.5 26.67,87.96 28.73,87.96 28.75,87.92 29.36,87.92 29.41,87.96 v1(30.89,87.96) ; v1(38.81,88.21) 38.68,88.34 v1(36.87,88.34)
  Bottom Layer w0.254: U17.33 61.41,83.49 60.04,84.86 40.09,84.86 38.18,86.78 38.18,87.58 v1(38.81,88.21) ; v1(36.87,88.34) 36.44,88.77 34.54,88.77 33.63,87.86 30.99,87.86 v1(30.89,87.96)
IO41: length 42.3
  Top Layer w0.254: CC?_.6 24.99,87.1 v1(30.94,87.1) ; v1(49.28,83.74) 48.9,84.12 v1(39.46,84.12)
  Bottom Layer w0.254: v1(30.94,87.1) 31.34,87.5 33.68,87.5 33.86,87.32 33.86,86.81 34.2,86.47 36.14,86.47 36.32,86.29 37.13,86.29 37.46,85.95 37.46,85.76 39.07,84.15 39.43,84.15 v1(39.46,84.12) ; U17.34 60.14,82.88 58.52,84.51 50.04,84.51 v1(49.28,83.74)
IO42: length 44
  Top Layer w0.254: CC?_.7 30.37,85.67 v1(30.94,86.23) ; v1(36.86,80.39) 39.12,80.39 41.5,82.78 49.53,82.78 v1(50.04,83.29)
  Bottom Layer w0.254: v1(50.04,83.29) 50.9,84.15 57.91,84.15 58.87,83.19 U17.35 ; v1(30.94,86.23) 31.8,87.1 32.97,87.1 34.14,85.93 36.88,85.93 37.11,85.69 37.11,85.61 37.21,85.51 37.21,84.88 37.11,84.79 37.11,83.18 37.08,83.15 37.08,81.36 36.86,81.13 v1(36.86,80.39)
IO46: length 165.2
  Top Layer w0.254: v1(21.79,84.86) 22.02,85.09 22.85,85.09 23.53,84.4 27.25,84.4 27.93,85.09 31.11,85.09 36.35,90.32 36.35,90.83 ; v1(67.46,86.69) 69.1,86.69 69.42,86.36 69.42,94.13 v1(68.73,94.82)
  Bottom Layer w0.254: RL1.2 2.03,14.86 3.35,16.18 3.35,31.01 2.34,32.03 2.34,35.84 3.45,36.96 3.45,50.52 2.13,51.84 2.13,53.31 3.5,54.69 3.5,69.01 1.52,70.99 1.52,71.25 3.5,73.23 3.5,82.83 3.76,83.08 6.44,83.08 7.05,82.48 8.68,82.48 9.28,83.08 20.02,83.08 v1(21.79,84.86) ; v1(68.73,94.82) 68.86,94.94 U17.16 ; v1(67.46,86.69) 67.11,86.69 66.53,86.11 51.95,86.11 51.36,86.69 45.67,86.69 41.61,90.75 v1(36.52,90.75)
IO47: length 90.7
  Top Layer w0.254: v1(66.4,84.3) 65.02,84.3 64.59,83.87 64.04,83.87 57.15,76.98 57.15,67.24 57.58,66.81 57.58,66.48 58.42,65.65 v1(58.42,65.61) ; v1(28.9,69.82) 27.64,71.09 26.47,71.09 22.76,74.81 22.76,75.97 22.45,76.28 22.45,81.66 19.96,84.15 19.96,84.25 18.44,85.78 v1(18.44,87.3)
  Bottom Layer w0.254: U17.24 69.31,84.78 68.83,84.3 v1(66.4,84.3) ; v1(18.44,87.3) 21.26,90.12 23.25,90.12 CC?_.4 ; v1(58.42,65.61) 57.56,65.61 57.4,65.46 57.4,65.46 56.28,64.34 33.08,64.34 31.96,65.46 31.95,65.46 28.9,68.5 v1(28.9,69.82)
IO48: length 83.4
  Top Layer w0.254: v1(30.89,70.13) 29.57,71.45 26.62,71.45 23.11,74.95 23.11,81.51 20.32,84.3 20.32,85.57 20.5,85.75 23.79,85.75 CC?_.8 ; v1(58.17,66.73) 57.51,67.39 57.51,76.83 64.19,83.51 v1(66.4,83.51)
  Bottom Layer w0.254: U17.25 v1(66.4,83.51) ; v1(30.89,70.13) 30.89,67.03 33.22,64.69 56.13,64.69 v1(58.17,66.73)
RX: length 85.2
  Top Layer w0.254: v1(54.56,83.49) 54.99,83.06 54.99,5.99 H3.2
  Bottom Layer w0.254: U17.36 57.6,81.82 55.93,83.49 v1(54.56,83.49)
TX: length 84.8
  Top Layer w0.254: H3.1 54.15,4.29 54.15,82.02 v1(54.41,82.27)
  Bottom Layer w0.254: 56.33,80.48 56.33,81.06 55.12,82.27 v1(54.41,82.27)
$1N17024: length 4.3
  Bottom Layer w0.254: LED1.1 3.99,1.99 RL1.1
$1N17244: length 7.7
  Bottom Layer w0.254: LED2.1 26.09,2.34 RL2.1
$1N17270: length 7.6
  Bottom Layer w0.254: RL3.1 45.09,2.42 LED3.1
$1N17296: length 7.4
  Bottom Layer w0.254: LED4.1 64.35,2.24 RL4.1
$1N41929: length 6.5
  Top Layer w0.254: v1(33.83,92.48) 32.71,92.48 v1(32.21,91.97)
  Bottom Layer w0.254: 32.23,88.82 32.21,88.84 v1(32.21,91.97) ; v1(33.83,92.48) 33.83,92.64 34.25,93.05 34.25,93.75 USB1.A5
$1N42156: length 21
  Top Layer w0.254: v1(34.9,95.2) v1(34.9,96.57)
  Bottom Layer w0.254: v1(34.9,96.57) 31.02,96.57 30.28,95.83 30.28,87.01 29.34,86.08 29.34,85.32 ; USB1.B5 37.32,94.53 36.22,95.63 35.33,95.63 v1(34.9,95.2)
$1N52929: length 10.7
  Bottom Layer w0.254: RL5.1 18.54,96.45 17.27,97.71 10.41,97.71 10.23,97.53 10.23,97.28 10.36,97.15 LEDIR.1
$1N52957: length 8.5
  Bottom Layer w0.254: RL5.2 15.65,94.92 14.76,94.03 14.13,94.03 10.08,89.98 Q1.2
$1N53158: length 19.8
  Bottom Layer w0.254: R22.2 2.11,89.64 3.67,88.08 Q1.1 15.38,88.08 18.46,91.16 RL6.1

## Copper pours and planes (outline as drawn; the poured copper is in the pictures)
GND on Top Layer: 0,100 71.58,100 71.58,0 0,0
